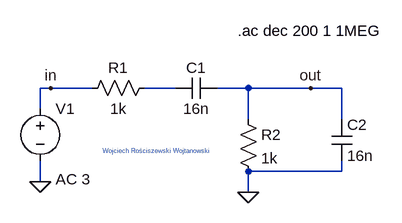
[diagram p0: schematic Wien Bridge Oscillator.asc]
Wien Bridge Oscillator.asc, the LTspice schematic file:
Version 4
SHEET 1 880 680
WIRE 64 96 48 96
WIRE 128 96 64 96
WIRE 256 96 208 96
WIRE 368 96 320 96
WIRE 464 96 368 96
WIRE 512 96 464 96
WIRE 48 128 48 96
WIRE 368 144 368 96
WIRE 512 144 512 96
WIRE 512 224 512 208
WIRE 512 224 368 224
WIRE 48 240 48 208
WIRE 368 256 368 224
FLAG 48 240 0
FLAG 368 256 0
FLAG 464 96 out
FLAG 64 96 in
SYMBOL voltage 48 112 R0
WINDOW 123 24 124 Left 2
WINDOW 39 0 0 Left 0
SYMATTR InstName V1
SYMATTR Value ""
SYMATTR Value2 AC 3
SYMBOL res 224 80 R90
WINDOW 0 0 56 VBottom 2
WINDOW 3 32 56 VTop 2
SYMATTR InstName R1
SYMATTR Value 1k
SYMBOL cap 320 80 R90
WINDOW 0 0 32 VBottom 2
WINDOW 3 32 32 VTop 2
SYMATTR InstName C1
SYMATTR Value 16n
SYMBOL res 352 128 R0
SYMATTR InstName R2
SYMATTR Value 1k
SYMBOL cap 496 144 R0
SYMATTR InstName C2
SYMATTR Value 16n
TEXT 144 192 Left 0 ;Wojciech Rościszewski Wojtanowski
TEXT 352 8 Left 2 !.ac dec 200 1 1MEG

The netlist it stands for:
* Wien Bridge Oscillator.asc
V1 in 0 AC 3
R1 N001 in 1k
C1 out N001 16n
R2 out 0 1k
C2 out 0 16n
* Wojciech Rościszewski Wojtanowski
.ac dec 200 1 1MEG
.backanno
.end